# EAGLE design solene (EAGLE 6.5.0)
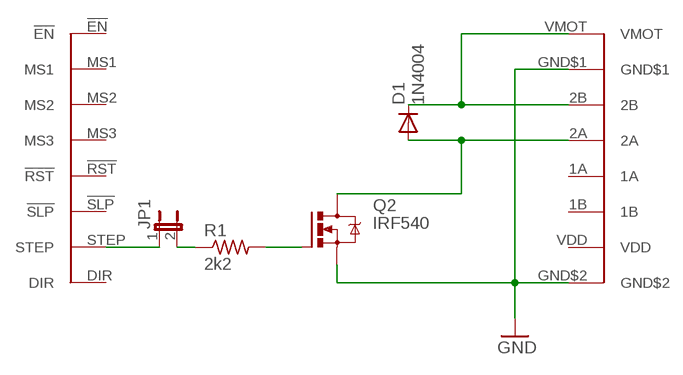
[diagram p0: schematic, sheet 1]

## Parts
D1  1N4004  DIODE-D-2.5  [D-2.5]
J1X  CLONOLU  [CLONOLU]
JP1  JUMPER-2PTH  [1X02]
Q2  IRF540  [TO220BV]
R1  2k2  R-US_0204/2V  [0204V]

## Nets
GND: J1X.GND$1(A4983$2:GND$1) J1X.GND$2(A4983$2:GND$2) Q2.S
N$1: J1X.STEP(A4983$1:STEP) JP1.1
N$2: JP1.2 R1.1
N$3: Q2.G R1.2
N$4: D1.C J1X.2B(A4983$2:2B) J1X.VMOT(A4983$2:VMOT)
N$5: D1.A J1X.2A(A4983$2:2A) Q2.D
Unconnected: J1X.1A(A4983$2:1A) J1X.1B(A4983$2:1B) J1X.!EN(A4983$1:!EN) J1X.!RST(A4983$1:!RST) J1X.!SLP(A4983$1:!SLP) J1X.DIR(A4983$1:DIR) J1X.MS1(A4983$1:MS1) J1X.MS2(A4983$1:MS2) J1X.MS3(A4983$1:MS3)

## Power pins joined to a net without a drawn wire
VDD: J1X.VDD(A4983$2:VDD)

## Library data of the parts
D1 = diode:DIODE-: DIODE
J1X = pololu-allegro:CLONOLU
JP1 = SparkFun-Passives:JUMPER-2: Jumper Basic 0.1" spaced jumper. Use with breakaway headers.
Q2 = transistor-power:IRF540: HEXFET Power MOSFET
R1 = rcl:R-US_: RESISTOR, American symbol

## Board
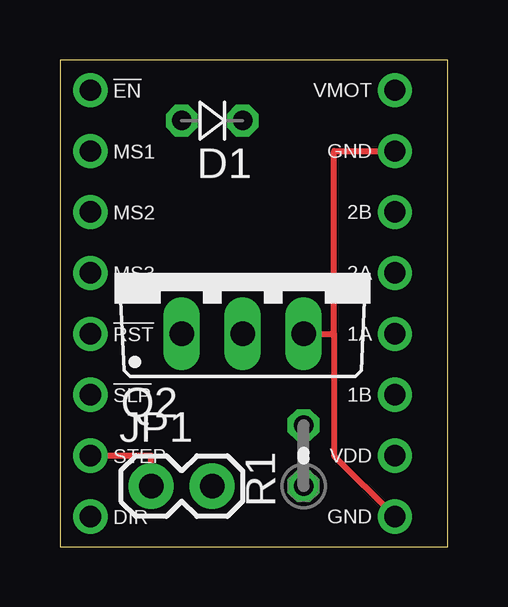
[diagram p1: board, top side]
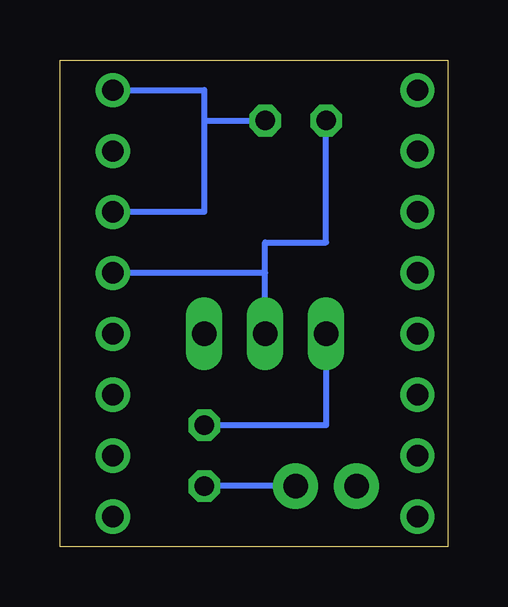
[diagram p2: board, bottom side, seen from below]

Size 16.18 x 20.31 mm. Coordinates in mm from the lower left corner, seen from the top.
Outline: 0,0 16.18,0 16.18,20.31 0,20.31 0,0
Copper layers (1*16): Top 0.035mm / dielectric 1.5mm / Bottom 0.035mm
Design rules "default": minimum track width 10mil, minimum drill 24mil, track to track 8mil, track to pad 8mil, pad to pad 8mil, via to via 8mil, smd to smd 8mil, copper to edge 40mil, drill to drill 8mil, minimum pad ring 10mil, minimum via ring 8mil, stop-mask expansion 4mil, vias tented up to drill 0mil, thermal gap 10mil

### Footprints (pad centres in the part's own frame; a part is rotated, then mirrored left to right if it is on the bottom)
D-2.5 = drill 0.813 octagon: A 1.27,0; C -1.27,0
CLONOLU = drill 0.889 pad 1.422: 1A 6.35,-1.27; 1B 6.35,-3.81; 2A 6.35,1.27; 2B 6.35,3.81; !EN -6.35,8.89; !RST -6.35,-1.27; !SLP -6.35,-3.81; DIR -6.35,-8.89; GND$1 6.35,6.35; GND$2 6.35,-8.89; MS1 -6.35,6.35; MS2 -6.35,3.81; MS3 -6.35,1.27; STEP -6.35,-6.35; VDD 6.35,-6.35; VMOT 6.35,8.89
1X02 = drill 1.016 pad 1.88: 1 0,0; 2 2.54,0
TO220BV = drill 1.016 long: D 0,-2.54; G -2.54,-2.54; S 2.54,-2.54
0204V = drill 0.813 octagon: 1 -1.27,0; 2 1.27,0

### Placement (x,y rotation side)
D1  6.35,17.78 180 top
J1X  7.62,10.16 0 top
JP1  3.81,2.54 0 top
Q2  7.62,11.43 0 top
R1  10.16,3.81 90 top

### Tracks (layer width: path | path; a pad name or v marks a point on that pad's centre or on a via)
GND
  Top 0.254: J1X.GND$2 11.43,3.81 11.43,8.89 | 11.43,8.89 11.43,16.51 J1X.GND$1 | Q2.S 11.43,8.89
N$1
  Top 0.254: J1X.STEP 3.81,3.81 JP1.1
N$2
  Bottom 0.254: JP1.2 R1.1
N$3
  Bottom 0.254: R1.2 5.08,5.08 Q2.G
N$4
  Bottom 0.254: 10.16,17.78 10.16,19.05 J1X.VMOT | 10.16,17.78 D1.C | 10.16,17.78 10.16,13.97 J1X.2B
N$5
  Bottom 0.254: D1.A 5.08,12.7 7.62,12.7 7.62,11.43 | 7.62,11.43 J1X.2A | Q2.D 7.62,11.43